# Altium schematic sheet 03 Power DC.SchDoc: POWER DC
size A4; DrawnBy: Cuong RnD HW; Revision: V4.0
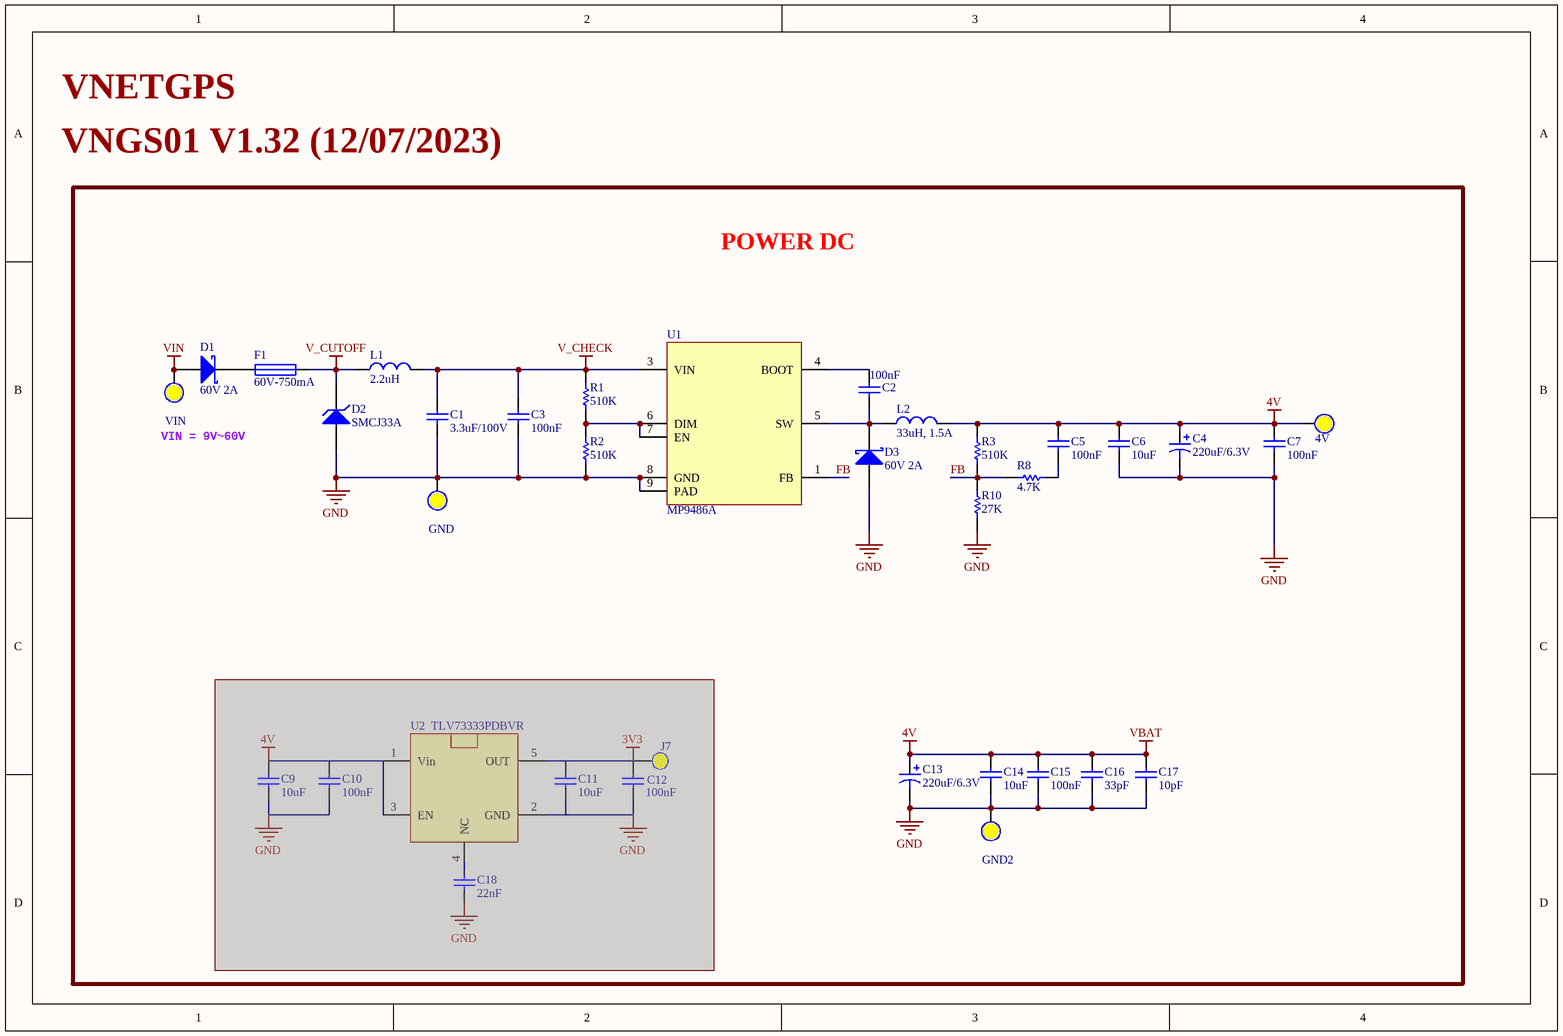
[diagram p0: 03 Power DC.SchDoc]

## Parts
4V  (no value)  [Test Point 1 MM]  (no BOM)
C1  3.3uF/100V  [1210 - C]
C2  100nF  [0603 - C]
C3  100nF  [0603 - C]
C4  220uF/6.3V  [CAP_ALUM_SMD_6354_TYPE_D]
C5  100nF  [0603 - C]
C6  10uF  [0603 - C]
C7  100nF  [0603 - C]
C9  10uF  [0603 - C]  (masked out: inside a compile mask, not in the netlist)
C10  100nF  [0603 - C]  (masked out: inside a compile mask, not in the netlist)
C11  10uF  [0603 - C]  (masked out: inside a compile mask, not in the netlist)
C12  100nF  [0603 - C]  (masked out: inside a compile mask, not in the netlist)
C13  220uF/6.3V  [CAP_ALUM_SMD_6354_TYPE_D]
C14  value 10uF  [0603 - C]  (hidden comment: 1uF)
C15  100nF  [0603 - C]
C16  33pF  [0603 - C]
C17  10pF  [0603 - C]
C18  22nF  [0603 - C]  (masked out: inside a compile mask, not in the netlist)
D1  60V 2A  [SOD-123]
D2  SMCJ33A  [DIODE - SMC]
D3  60V 2A  [SOD-123]
F1  60V-750mA  [2016 - Fuse]
GND  (no value)  [Test Point 1 MM]  (no BOM)
GND2  (no value)  [Test Point 1 MM]  (no BOM)
J7  Test Point  [TP1]  (value not drawn)  (masked out: inside a compile mask, not in the netlist)
L1  2.2uH  [1210 - L]
L2  33uH, 1.5A  [INDUCTOR-5D28]
R1  510K  [0603 - R]
R2  510K  [0603 - R]
R3  510K  [0603 - R]
R8  4.7K  [0603 - R]
R10  27K  [0603 - R]
U1  MP9486A  [SOIC8 - POWER]
U2  TLV73333PDBVR  [SOT23-5]  (masked out: inside a compile mask, not in the netlist)
VIN  (no value)  [Test Point 1 MM]  (no BOM)

## Nets
4V: 4V.0 C4.1 C5.1 C6.2 C7.2 C13.1 C14.2 C15.2 C16.2 C17.2 L2.2 R3.2  [also labelled VBAT]
GND: C1.1 C3.1 C4.2 C6.1 C7.1 C13.2 C14.1 C15.1 C16.1 C17.1 D2.1(A) D3.1(A) GND.0 GND2.0 R2.1 R10.1 U1.8(GND) U1.9(PAD)
V_CHECK: C1.2 C3.2 L1.2 R1.2 U1.3(VIN)
V_CUTOFF: D2.2(K) F1.2 L1.1
VIN: D1.1(A) VIN.0
FB: R3.1 R8.1 R10.2 U1.1(FB)
NetC2_1: C2.1 U1.4(BOOT)
NetC2_2: C2.2 D3.2(K) L2.1 U1.5(SW)
NetC5_2: C5.2 R8.2
NetD1_2: D1.2(K) F1.1
NetR1_1: R1.1 R2.2 U1.6(DIM) U1.7(EN)

## Notes on the sheet
- VNETGPS
- VNGS01 V1.32 (12/07/2023)
- POWER DC
- VIN = 9V~60V

## Library data of the parts
4V GND GND2 VIN = Test Point: Solder: NF
C1 = Cap 1210 3.3uF: CAP CER 3.3UF 100V X7S 1210; MPN: C3225X7S2A335M200AB; MFR: TDK Corporation; Company ID: VT_CAP_C1210 3.3uF 100V; Size: C1210: 3.3uF/100V; MPN2: 885012209071; Value: 3.3uF/100V
C2 C3 C5 C7 C10 C12 C15 = Cap 0603 100nF: CAP CER 100nF 50V C0G/NP0 0603; MPN: CL10C104JB8NNNC; MFR: SAMSUNG; Company ID: VT_TỤ ĐIỆN_C0603 100nF; Voltage: 50V; Package: 0603; Value: 100nF; Size: C0603: 100nF
C4 C13 = Cap Alu 220uF/6.3V: CAP.EL.220uF 6.3V 6.3x5.4 85C 2000H SMT; MPN: CS006M221E5APKKKV00R; MFR: Su'scon; Company ID: VT_CAP ALU 220uF 6.3V; Value: 220uF/6.3V
C6 C9 C11 C14 = Cap 0603 10uF: CAP CER 10UF 16V X5R 0603; MPN: EMK107BBJ106MA-T; MFR: Yageo; Company ID: VT_CAP_C0603 10uF; Size: C0603: 10uF; Package: 0603
  C6 C9 C11: Value: 10uF
C16 = Cap 0603 33pF: CAP CER 33PF 50V C0G 0603; MFR: Yageo; MPN: AC0603FRNPO9BN330; Company ID: VT_CAP_C0603 33pF; Size: C0603: 33pF; Value: 33pF
C17 = Cap 0603 10pF: CAP CER 10PF 50V C0G/NP0 0603; MPN: CL10C100JB8NNNC; MFR: SAMSUNG; Company ID: VT_CAP_C0603 10pF; Size: C0603: 10pF; Value: 10pF
C18 = Cap 0603 22nF_1: CAP CER 0.022UF 50V X7R 0603; MPN: CL10B823KB8NNNC; MFR: SAMSUNG; Company ID: VT_CAP_C0603 22nF; Size: C0603: 82nF; Value: 22nF
D1 D3 = Diode PMEG6020ER: DIODE SCHOTTKY 60V 2A SOD123W; MPN: PMEG6020ER,115; MFR: NXP; Company ID: VT_DIODE_PMEG6020ER
D2 = SMCJ33A: TVS DIODE 33V 36.7V; MFR: Bourns Inc.; MPN: SMCJ33ABTR-ND; Company ID: VT_DIODE_ SMCJ33
F1 = Fuse 60V - 750mA: PTC RESET FUSE 60V 750MA 2016; MFR: Littelfuse Inc.; MPN: 2016L075/60MR; Company ID: VT_Fuse_60V - 750mA
J7 = TP: 1mm - 1 layer
L1 = Inductor 3225 2.2uH: FIXED IND 2.2UH 1.6A 76 MOHM SMD; MPN: LQH32PN2R2NN0; MFR: Murata; Company ID: VT_IND_3225 2.2uH; Value: 2.2uH; Size: L3225: 2.2uH; MPN2: SWPA3015S2R2NT
L2 = Inductor 33uH, 1.5A: FIXED IND 33UH 1.5A 286 MOHM SMD; MPN: SWPA6028S330MT; MFR: SunLord; Company ID: VT_IND_33uH/1.5A
R1 R2 = Res 0603 510K: RES SMD 510K OHM 1% 1/10W 0603; MFR: Yageo; MPN: RC0603FR-07510KL; Company ID: VT_ĐIỆN TRỞ_R0603 510K; Value: 510K; Size: R0603: 510K
R3 = Res 0603 510K: RES SMD 510K OHM 1% 1/10W 0603; MFR: Yageo; MPN: RC0603FR-07510KL; Company ID: VT_RES_R0603 510K; Size: R0603: 510K; Value: 510K
R8 = Res 0603 4.7K: RES SMD 4.7K OHM 1% 1/10W 0603; MFR: Yageo; MPN: RC0603FR-074K7L; Company ID: VT_RES_R0603 4.7K; Size: R0603: 4.7K; Value: 4.7K
R10 = Res 0603 27K: RES SMD 27K OHM 1% 1/10W 0603; MFR: YAGEO; MPN: AF0603FR-0727KL; Company ID: VT_RES_R0603 27K; Size: R0603: 27K; Value: 27K
U1 = MP9486AG: IC REG 100V INPT 3.5A SWITCH CUR; MPN: MP9486AGN-Z; MFR: MPS; Company ID: VT_IC_MP9486A
U2 = TLV73333PDBVR: IC REG LINEAR 3.3V 300MA SOT23-5; MFR: TI; Company ID: VT_IC_TLV73333; MPN: TLV73333PDBVR